# EAGLE design perfboard-tiny45usb3 (EAGLE 5.10)
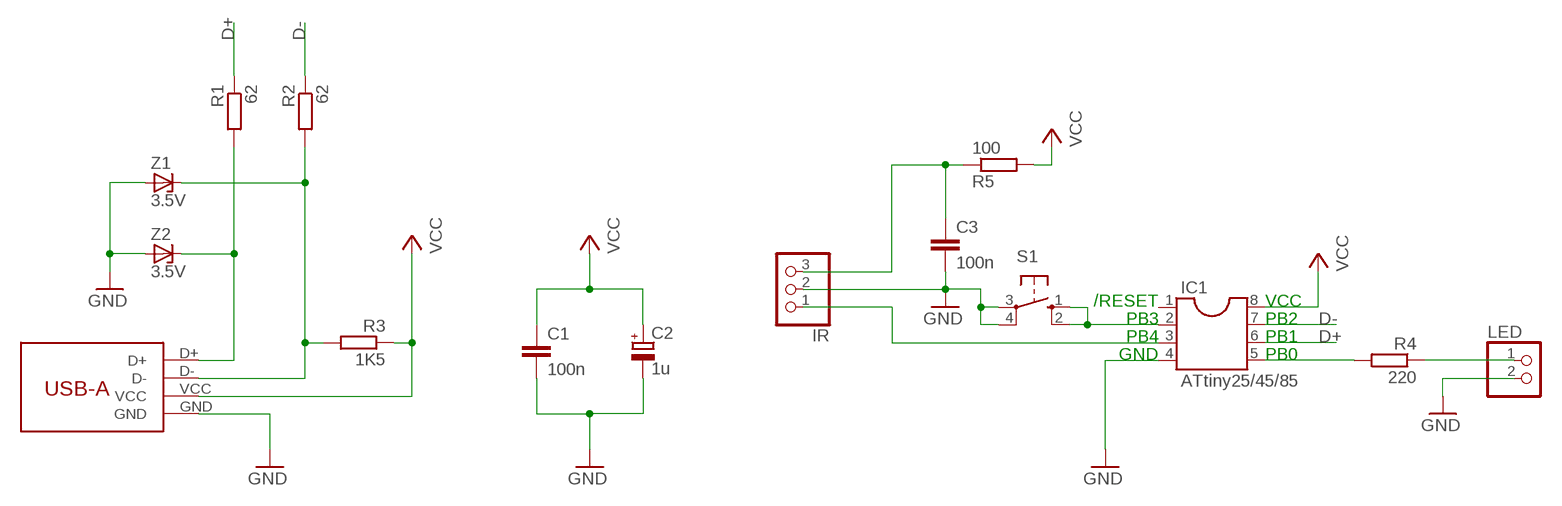
[diagram p0: schematic, sheet 1]

## Parts
C1  100n  C-EU025-024X044  [C025-024X044]
C2  1u  CPOL-EUE2,5-6E  [E2,5-6E]
C3  100n  C-EU025-024X044  [C025-024X044]
IC1  ATtiny25/45/85  DIL8  [DIL08]
IR  PINHD-1X3  [1X03]
LED  PINHD-1X2  [1X02]
R1  62  R-EU_0204/2V  [0204V]
R2  62  R-EU_0204/2V  [0204V]
R3  1K5  R-EU_0207/2V  [0207/2V]
R4  220  R-EU_0207/15  [0207/15]
R5  100  R-EU_0204/2V  [0204V]
S1  10-XX  [B3F-10XX]
U$2  USB-A  [DIP]
Z1  3.5V  ZENER-DIODEZD-10  [ZDIO-10]
Z2  3.5V  ZENER-DIODEZD-7.5  [ZDIO-7.5]

## Nets
D+: IC1.6 R1.1
D-: IC1.7 R2.1
GND: C1.2 C2.- C3.2 IC1.4 IR.2 LED.2 S1.3(P) S1.4(P1) U$2.GND Z1.A Z2.A
N$1: R1.2 U$2.D+ Z2.C
N$2: R2.2 R3.2 U$2.D- Z1.C
N$3: LED.1 R4.1
N$4: IC1.5 R4.2
N$5: IC1.3 IR.1
N$6: IC1.2 S1.1(S) S1.2(S1)
N$7: C3.1 IR.3 R5.1
VCC: C1.1 C2.+ IC1.8 R3.1 R5.2 U$2.VCC
Unconnected: IC1.1

## Notes on the sheet
- /RESET | VCC
- PB3 | PB2
- PB4 | PB1
- GND | PB0

## Library data of the parts
C1 C3 = rcl:C-EU: CAPACITOR, European symbol
C2 = rcl:CPOL-EU: POLARIZED CAPACITOR, European symbol
IC1 = ic-package:DIL8: Dual In Line / Socket
IR = pinhead:PINHD-1X3: PIN HEADER
LED = pinhead:PINHD-1X2: PIN HEADER
R1-R5 = rcl:R-EU_: RESISTOR, European symbol
S1 = switch-omron:10-XX: OMRON SWITCH
U$2 = assmann-usb-a-dip:USB-A
Z1 Z2 = diode:ZENER-DIODE: Z-Diode

## Board
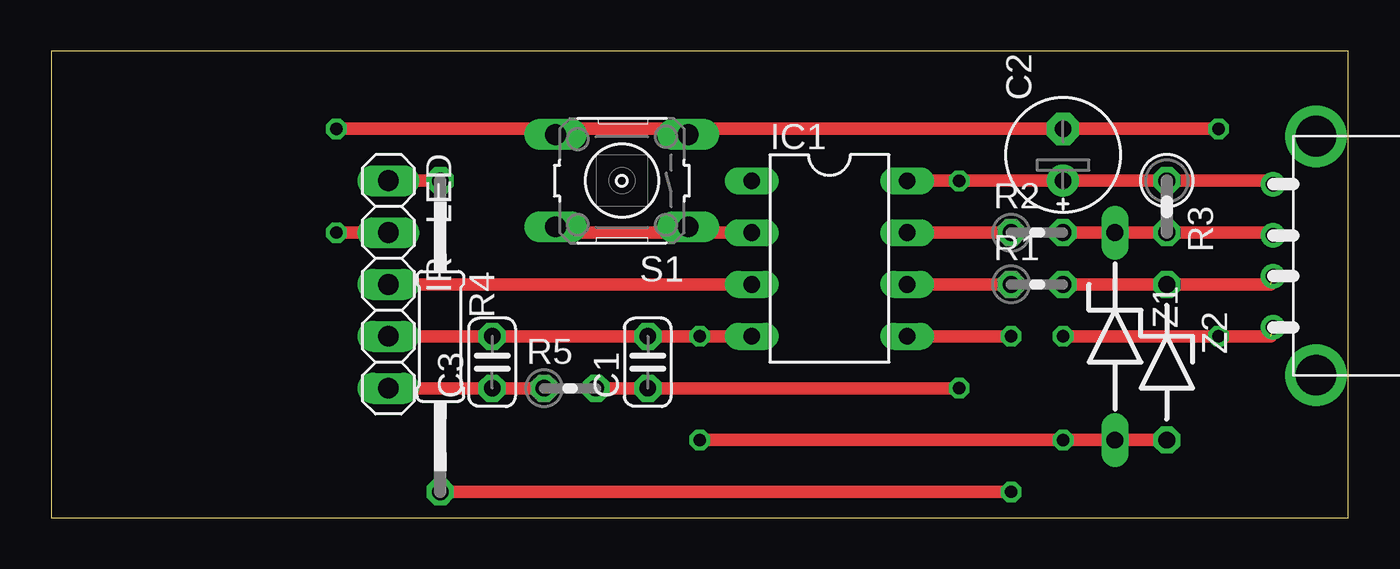
[diagram p1: board, top side]
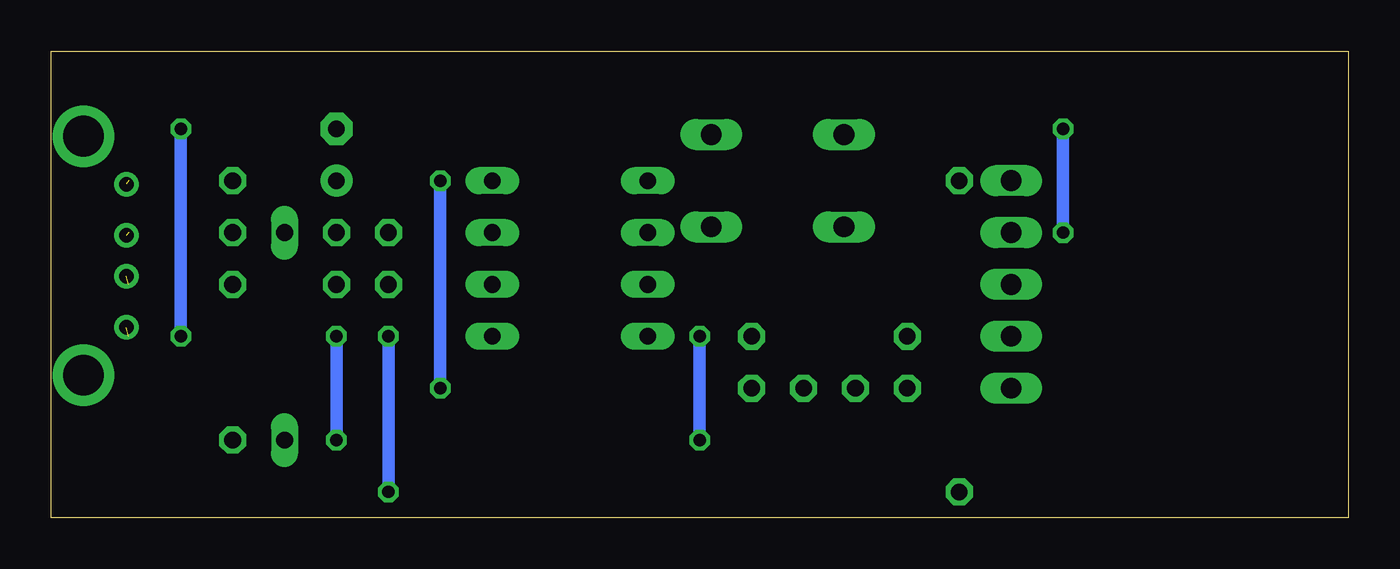
[diagram p2: board, bottom side, seen from below]

Size 63.5 x 22.86 mm. Coordinates in mm from the lower left corner, seen from the top.
Outline: 0,0 63.5,0 63.5,22.86 0,22.86 0,0
Copper layers (1*16): Top 0.035mm / dielectric 1.5mm / Bottom 0.035mm
Design rules "default": minimum track width 10mil, minimum drill 24mil, track to track 8mil, track to pad 8mil, pad to pad 8mil, via to via 8mil, smd to smd 8mil, copper to edge 40mil, drill to drill 8mil, minimum pad ring 10mil, minimum via ring 8mil, stop-mask expansion 4mil, vias tented up to drill 0mil, thermal gap 10mil

### Footprints (pad centres in the part's own frame; a part is rotated, then mirrored left to right if it is on the bottom)
C025-024X044 = drill 0.813 octagon: 1 -1.27,0; 2 1.27,0
E2,5-6E = drill 0.813 pad 1.575 round: + -1.27,0 | drill 0.813 pad 1.575 octagon: - 1.27,0
DIL08 = drill 0.813 long: 1 -3.81,-3.81; 2 -1.27,-3.81; 3 1.27,-3.81; 4 3.81,-3.81; 5 3.81,3.81; 6 1.27,3.81; 7 -1.27,3.81; 8 -3.81,3.81
1X03 = drill 1.016 long: 1 -2.54,0; 2 0,0; 3 2.54,0
1X02 = drill 1.016 long: 1 -1.27,0; 2 1.27,0
0204V = drill 0.813 octagon: 1 -1.27,0; 2 1.27,0
0207/2V = drill 0.813 octagon: 1 -1.27,0; 2 1.27,0
0207/15 = drill 0.813 octagon: 1 -7.62,0; 2 7.62,0
B3F-10XX = drill 1.016 long: 1 -3.251,2.261; 2 3.251,2.261; 3 -3.251,-2.261; 4 3.251,-2.261
DIP = drill 0.7 round: D+ 4.85,2.1; D- 6.85,2.1; GND 2.35,2.1; VCC 9.35,2.1 | drill 2 round: P$1 0,0; P$2 11.7,0
ZDIO-10 = drill 0.813 long: A 5.08,0; C -5.08,0
ZDIO-7.5 = drill 0.813 octagon: A 3.81,0; C -3.81,0

### Placement (x,y rotation side)
C1  29.21,7.62 90 top
C2  49.53,17.78 90 top
C3  21.59,7.62 90 top
IC1  38.1,12.7 270 top
IR  16.51,8.89 270 top
LED  16.51,15.24 270 top
R1  48.26,11.43 0 top
R2  48.26,13.97 0 top
R3  54.61,15.24 270 top
R4  19.05,8.89 270 top
R5  25.4,6.35 0 top
S1  27.94,16.51 180 top
U$2  61.91,6.98 90 top
Z1  52.07,8.89 270 top
Z2  54.61,7.62 270 top

### Tracks (layer width: path | path; a pad name or v marks a point on that pad's centre or on a via)
D+
  Top 0.61: IC1.6 R1.1
D-
  Top 0.61: IC1.7 R2.1
GND  (via drill 0.6)  (1 unrouted)
  Top 0.61: v57.15,19.05 C2.- 31.47,19.05 S1.3 30.91,19.05 24.97,19.05 arc90 S1.4 24.69,19.05 v13.97,19.05 | v49.53,8.89 v57.15,8.89 59.69,8.89 | Z2.A Z1.A v49.53,3.81 v31.75,3.81 | IC1.4 v31.75,8.89 C1.2 C3.2 IR.2 | v13.97,13.97 LED.2
  Bottom 0.61: v57.15,8.89 v57.15,19.05 | v49.53,3.81 v49.53,8.89 | v31.75,8.89 v31.75,3.81 | v13.97,19.05 v13.97,13.97
N$1  (1 unrouted)
  Top 0.61: R1.2 Z2.C 59.69,11.43
N$2  (1 unrouted)
  Top 0.61: R2.2 Z1.C R3.2 59.69,13.97
N$3
  Top 0.61: R4.1 LED.1
N$4  (via drill 0.6)
  Top 0.61: v46.99,8.89 IC1.5 | v46.99,1.27 R4.2
  Bottom 0.61: v46.99,1.27 v46.99,8.89
N$5
  Top 0.61: IC1.3 IR.1
N$6
  Top 0.61: 31.19,13.97 IC1.2 | S1.1 31.19,13.97 | 31.19,13.97 24.69,13.97 S1.2
N$7
  Top 0.61: IR.3 C3.1 R5.1
VCC  (via drill 0.6)  (1 unrouted)
  Top 0.61: 59.69,16.51 R3.1 C2.+ v44.45,16.51 IC1.8 | v44.45,6.35 C1.1 R5.2
  Bottom 0.61: v44.45,6.35 v44.45,16.51

### Text on the board
Document: LED | + | - | TSOP | s | - | +